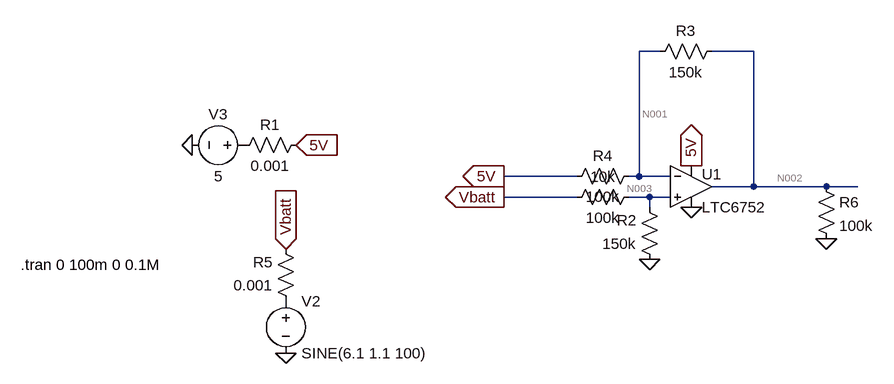
[diagram p0: schematic A6c.asc]
A6c.asc, the LTspice schematic file:
Version 4
SHEET 1 880 680
WIRE 96 -288 64 -288
WIRE 240 -288 176 -288
WIRE -32 -96 -144 -96
WIRE 64 -96 64 -288
WIRE 64 -96 48 -96
WIRE 112 -96 64 -96
WIRE 240 -80 240 -288
WIRE 240 -80 176 -80
WIRE 352 -80 240 -80
WIRE 400 -80 352 -80
WIRE -32 -64 -144 -64
WIRE 80 -64 48 -64
WIRE 112 -64 80 -64
WIRE 80 -48 80 -64
FLAG 144 -48 0
FLAG 80 32 0
FLAG -624 -144 0
FLAG -480 176 0
FLAG -464 -144 5V
IOPIN -464 -144 In
FLAG -144 -96 5V
IOPIN -144 -96 Out
FLAG 144 -112 5V
IOPIN 144 -112 Out
FLAG -480 16 Vbatt
IOPIN -480 16 In
FLAG -144 -64 Vbatt
IOPIN -144 -64 Out
FLAG 352 0 0
SYMBOL Comparators\\LTC6752 144 -144 R0
WINDOW 0 16 45 Left 2
SYMATTR InstName U1
SYMBOL voltage -480 80 R0
WINDOW 123 0 0 Left 0
WINDOW 39 0 0 Left 0
SYMATTR InstName V2
SYMATTR Value SINE(6.1 1.1 100)
SYMBOL res 64 -80 R90
WINDOW 0 0 56 VBottom 2
WINDOW 3 32 56 VTop 2
SYMATTR InstName 10k
SYMATTR Value 100k
SYMBOL res 96 48 R180
WINDOW 0 36 76 Left 2
WINDOW 3 36 40 Left 2
SYMATTR InstName R2
SYMATTR Value 150k
SYMBOL res 192 -304 R90
WINDOW 0 0 56 VBottom 2
WINDOW 3 32 56 VTop 2
SYMATTR InstName R3
SYMATTR Value 150k
SYMBOL res 64 -112 R90
WINDOW 0 0 56 VBottom 2
WINDOW 3 32 56 VTop 2
SYMATTR InstName R4
SYMATTR Value 100k
SYMBOL voltage -528 -144 R90
WINDOW 0 -32 56 VBottom 2
WINDOW 3 32 56 VTop 2
SYMATTR InstName V3
SYMATTR Value 5
SYMBOL res -448 -160 R90
WINDOW 0 0 56 VBottom 2
WINDOW 3 32 56 VTop 2
SYMATTR InstName R1
SYMATTR Value 0.001
SYMBOL res -464 112 R180
WINDOW 0 36 76 Left 2
WINDOW 3 36 40 Left 2
SYMATTR InstName R5
SYMATTR Value 0.001
SYMBOL res 336 -96 R0
SYMATTR InstName R6
SYMATTR Value 100k
TEXT -888 40 Left 2 !.tran 0 100m 0 0.1M

The netlist it stands for:
* A6c.asc
XU1 N003 N001 5V 0 N002 LTC6752  ; pins In+ In- V+ V- OUT
V2 P001 0 SINE(6.1 1.1 100)
R§10k N003 Vbatt 100k
R2 0 N003 150k
R3 N002 N001 150k
R4 N001 5V 100k
V3 P002 0 5
R1 5V P002 0.001
R5 P001 Vbatt 0.001
R6 N002 0 100k
.tran 0 100m 0 0.1M
.lib LTC7.lib
.backanno
.end

* Results of the author's LTspice run, read from the files saved beside the schematic
* Operating Point, zero values left out:
*   V(n001) = 3.706 V
*   V(n003) = 3.709 V
*   V(n002) = 1.629 V
*   V(5v) = 5 V
*   V(p001) = 6.1 V
*   V(vbatt) = 6.1 V
*   V(p002) = 5 V
*   I(R6) = 16.29 µA
*   I(R5) = 23.91 µA
*   I(R1) = -11.95 mA
*   I(R4) = -12.94 µA
*   I(R3) = -13.85 µA
*   I(R2) = -24.73 µA
*   I(10k) = -23.91 µA
*   I(V3) = -11.95 mA
*   I(V2) = -23.91 µA
*   Ix(u1:1) = -814 nA
*   Ix(u1:2) = -910.2 nA
*   Ix(u1:3) = 11.94 mA
*   Ix(u1:4) = -11.94 mA
*   Ix(u1:5) = -2.443 µA
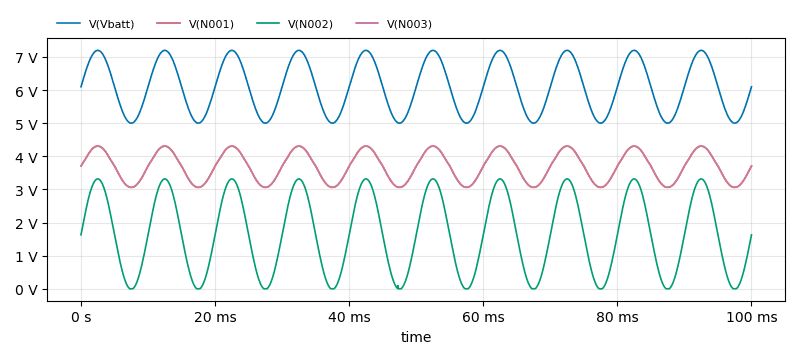
[diagram p1: Transient Analysis of A6c.asc, plotted from the saved traces]
* Transient Analysis, 1 run:
*   V(Vbatt): min 5.001 V, max 7.198 V, average 6.1 V, rms 6.149 V, last 6.1 V
*   V(N001): min 3.064 V, max 4.309 V, average 3.687 V, rms 3.712 V, last 3.706 V
*   V(N002): min 292.6 µV, max 3.318 V, average 1.643 V, rms 2.023 V, last 1.629 V
*   V(N003): min 3.064 V, max 4.306 V, average 3.687 V, rms 3.713 V, last 3.709 V